# EAGLE schematic twitter-magnet (EAGLE 6.5.0)
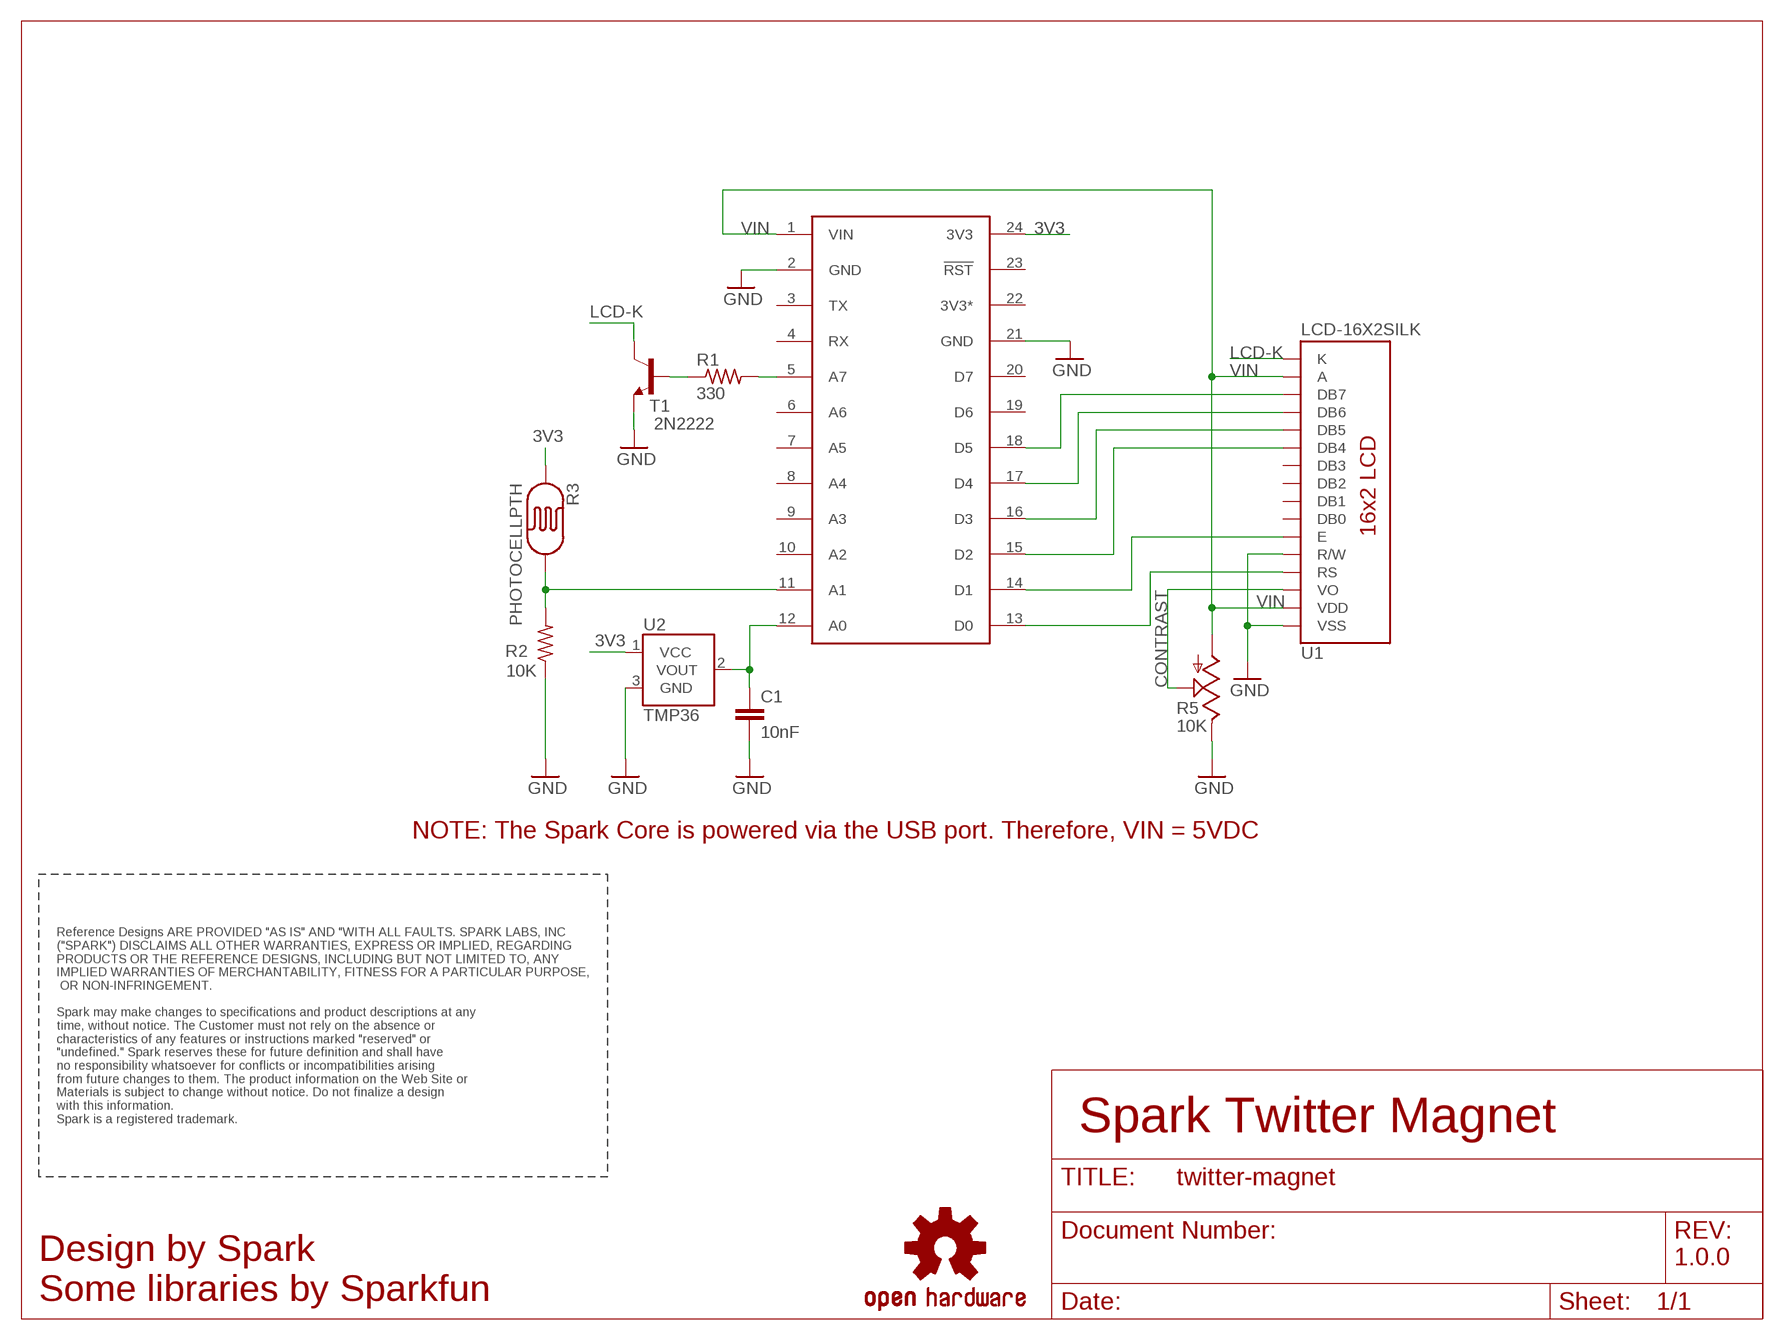
[diagram p0: schematic, sheet 1]

## Parts
C1  10nF  CAPEZ  [CAP-PTH-SMALLEZ]
LOGO1  OSHW-LOGOM  [OSHW-LOGO-M]
R1  330  R-US_0207/10  [0207/10]
R2  10K  R-US_0207/10  [0207/10]
R3  PHOTOCELLPTH  [PHOTOCELL]
R5  10K  TRIM_US-B25X  [B25X]
T1  2N2222  -NPN-TO92-EBC  [TO92-EBC]
U1  LCD-16X2SILK  [LCD-16X2]
U2  TMP36  TMP36TO-92-KIT  [TO-92-KIT]
U$1  SPARK_CORECORE  [SPARK_CORE]

## Nets
3V3: R3.1 U2.1(VCC) U$1.24(3V3)
CONTRAST: R5.S U1.3(VO)
GND: C1.2 R2.1 R5.E T1.E U1.1(VSS) U1.5(R/W) U2.3(GND) U$1.2(GND) U$1.21(GND)
LCD-K: T1.C U1.16(K)
N$1: U1.4(RS) U$1.13(D0)
N$2: U1.6(E) U$1.14(D1)
N$3: U1.11(DB4) U$1.15(D2)
N$4: U1.12(DB5) U$1.16(D3)
N$5: U1.13(DB6) U$1.17(D4)
N$6: U1.14(DB7) U$1.18(D5)
N$7: R1.2 U$1.5(A7)
N$8: R1.1 T1.B
N$10: C1.1 U2.2(VOUT) U$1.12(A0)
N$11: R2.2 R3.2 U$1.11(A1)
VIN: R5.A U1.2(VDD) U1.15(A) U$1.1(VIN)
Unconnected: U1.7(DB0) U1.8(DB1) U1.9(DB2) U1.10(DB3) U$1.3(TX) U$1.4(RX) U$1.6(A6) U$1.7(A5) U$1.8(A4) U$1.9(A3) U$1.10(A2) U$1.19(D6) U$1.20(D7) U$1.23(!RST)

## Notes on the sheet
- NOTE: The Spark Core is powered via the USB port. Therefore, VIN = 5VDC
- Reference Designs ARE PROVIDED "AS IS" AND "WITH ALL FAULTS. SPARK LABS, INC 
  ("SPARK") DISCLAIMS ALL OTHER WARRANTIES, EXPRESS OR IMPLIED, REGARDING 
  PRODUCTS OR THE REFERENCE DESIGNS, INCLUDING BUT NOT LIMITED TO, ANY 
  IMPLIED WARRANTIES OF MERCHANTABILITY, FITNESS FOR A PARTICULAR PURPOSE,
   OR NON-INFRINGEMENT.
  
  Spark may make changes to specifications and product descriptions at any 
  time, without notice. The Customer must not rely on the absence or 
  characteristics of any features or instructions marked "reserved" or 
  "undefined." Spark reserves these for future definition and shall have 
  no responsibility whatsoever for conflicts or incompatibilities arising 
  from future changes to them. The product information on the Web Site or 
  Materials is subject to change without notice. Do not finalize a design 
  with this information. 
  Spark is a registered trademark.
- Spark Twitter Magnet
- 1.0.0
- Design by Spark
  Some libraries by Sparkfun

## Power pins joined to a net without a drawn wire
3V3*: U$1.22(3V3*)

## Library data of the parts
C1 = SparkFun-Capacitors:CAP: Capacitor Standard 0603 ceramic capacitor, and 0.1" leaded capacitor.
LOGO1 = Spark:OSHW-LOGO: Open Source Hardware Logo This logo indicates the piece of hardware it is found on incorporates a OSHW license and/or adheres to the definition of open source hardware found here: http://freedomdefined.org/OSHW
R1 R2 = rcl:R-US_: RESISTOR, American symbol
R3 = SparkFun-Sensors:PHOTOCELL: CdS photoresistor. This is a low cost way to detect light levels. Resistance decreases with more incoming light. SparkFun SKU: SEN-09088
R5 = pot:TRIM_US-: POTENTIOMETER
T1 = transistor:*-NPN-: NPN Transistror BF959 corrected 2008.03.06
U1 = SparkFun-Displays:LCD-16X2: Standard text-only 16x2 parallel input LCD
U2 = SparkFun-Sensors:TMP36: Precision degC temp sensor, analog out
U$1 = Spark:SPARK_CORE